# EAGLE design untitled (EAGLE 5.07)
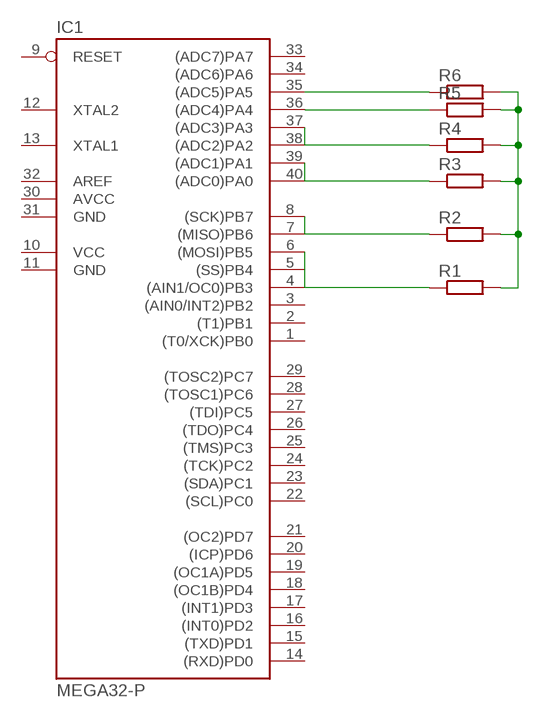
[diagram p0: schematic, sheet 1]

## Parts
IC1  MEGA32-P  [DIL40]
R1  R-EU_0207/10  [0207/10]
R2  R-EU_0207/10  [0207/10]
R3  R-EU_0207/10  [0207/10]
R4  R-EU_0207/10  [0207/10]
R5  R-EU_0207/10  [0207/10]
R6  R-EU_0207/10  [0207/10]

## Nets
N$1: IC1.35((ADC5)PA5) R6.1
N$2: IC1.36((ADC4)PA4) R5.1
N$3: IC1.37((ADC3)PA3) R4.1
N$4: IC1.39((ADC1)PA1) R3.1
N$5: IC1.8((SCK)PB7) R2.1
N$6: IC1.6((MOSI)PB5) R1.1
N$7: R1.2 R2.2 R3.2 R4.2 R5.2 R6.2
Unconnected: IC1.1((T0/XCK)PB0) IC1.2((T1)PB1) IC1.3((AIN0/INT2)PB2) IC1.4((AIN1/OC0)PB3) IC1.5((SS)PB4) IC1.7((MISO)PB6) IC1.9(RESET) IC1.12(XTAL2) IC1.13(XTAL1) IC1.14((RXD)PD0) IC1.15((TXD)PD1) IC1.16((INT0)PD2) IC1.17((INT1)PD3) IC1.18((OC1B)PD4) IC1.19((OC1A)PD5) IC1.20((ICP)PD6) IC1.21((OC2)PD7) IC1.22((SCL)PC0) IC1.23((SDA)PC1) IC1.24((TCK)PC2) IC1.25((TMS)PC3) IC1.26((TDO)PC4) IC1.27((TDI)PC5) IC1.28((TOSC1)PC6) IC1.29((TOSC2)PC7) IC1.32(AREF) IC1.33((ADC7)PA7) IC1.34((ADC6)PA6) IC1.38((ADC2)PA2) IC1.40((ADC0)PA0)

## Power pins joined to a net without a drawn wire
AVCC: IC1.30(AVCC)
GND: IC1.11(GND) IC1.31(GND)
VCC: IC1.10(VCC)

## Library data of the parts
IC1 = atmel:MEGA32-P: MICROCONTROLLER 32 Kbytes FLASH 2 Kbytes SRAM 1 Kbytes EEPROM USART 8-channel 10 bit ADC Source: www.atmel.com .. doc2503.pdf
R1-R6 = rcl:R-EU_: RESISTOR, European symbol

## Board
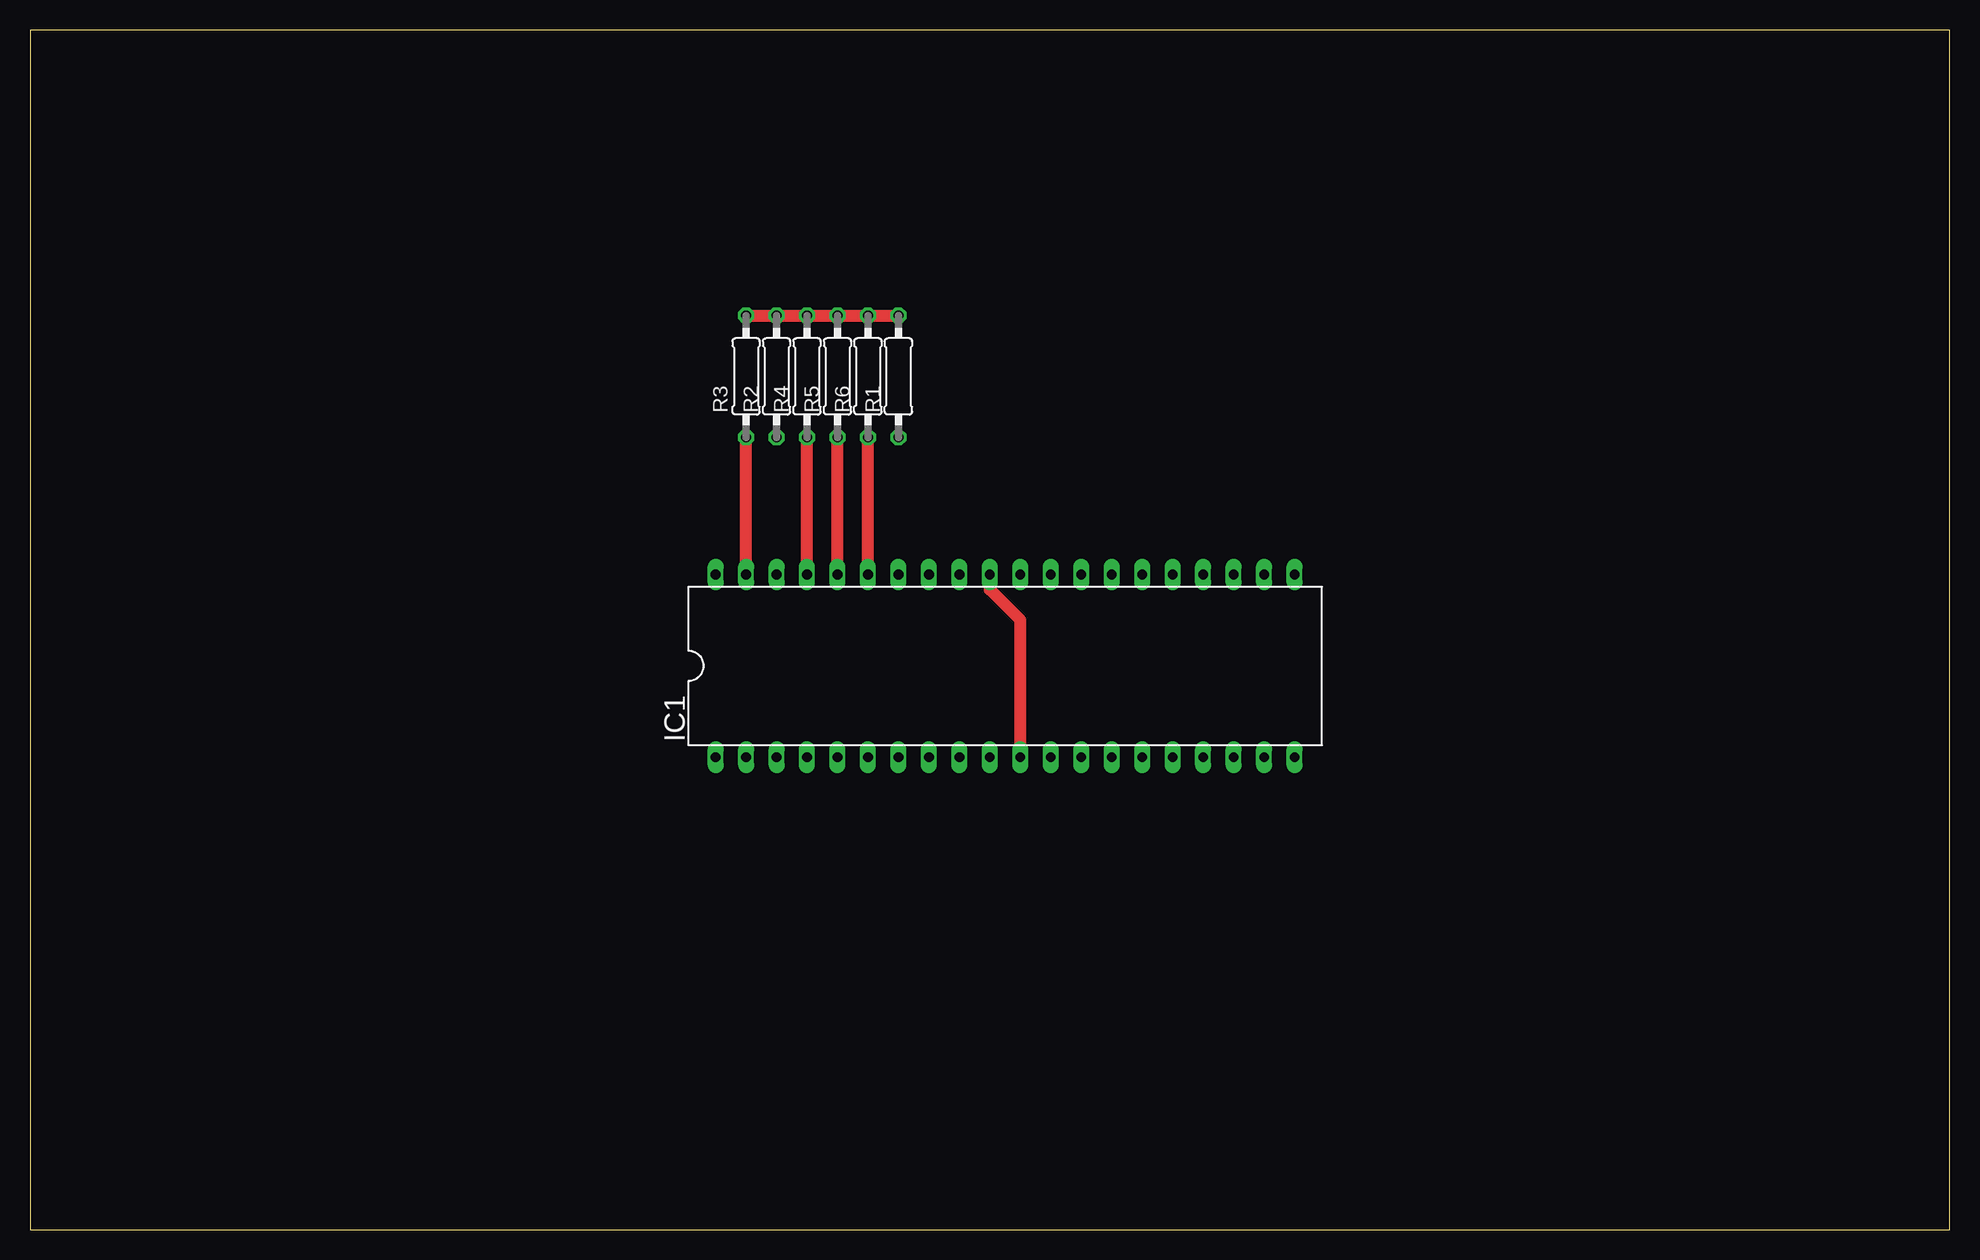
[diagram p1: board, top side]
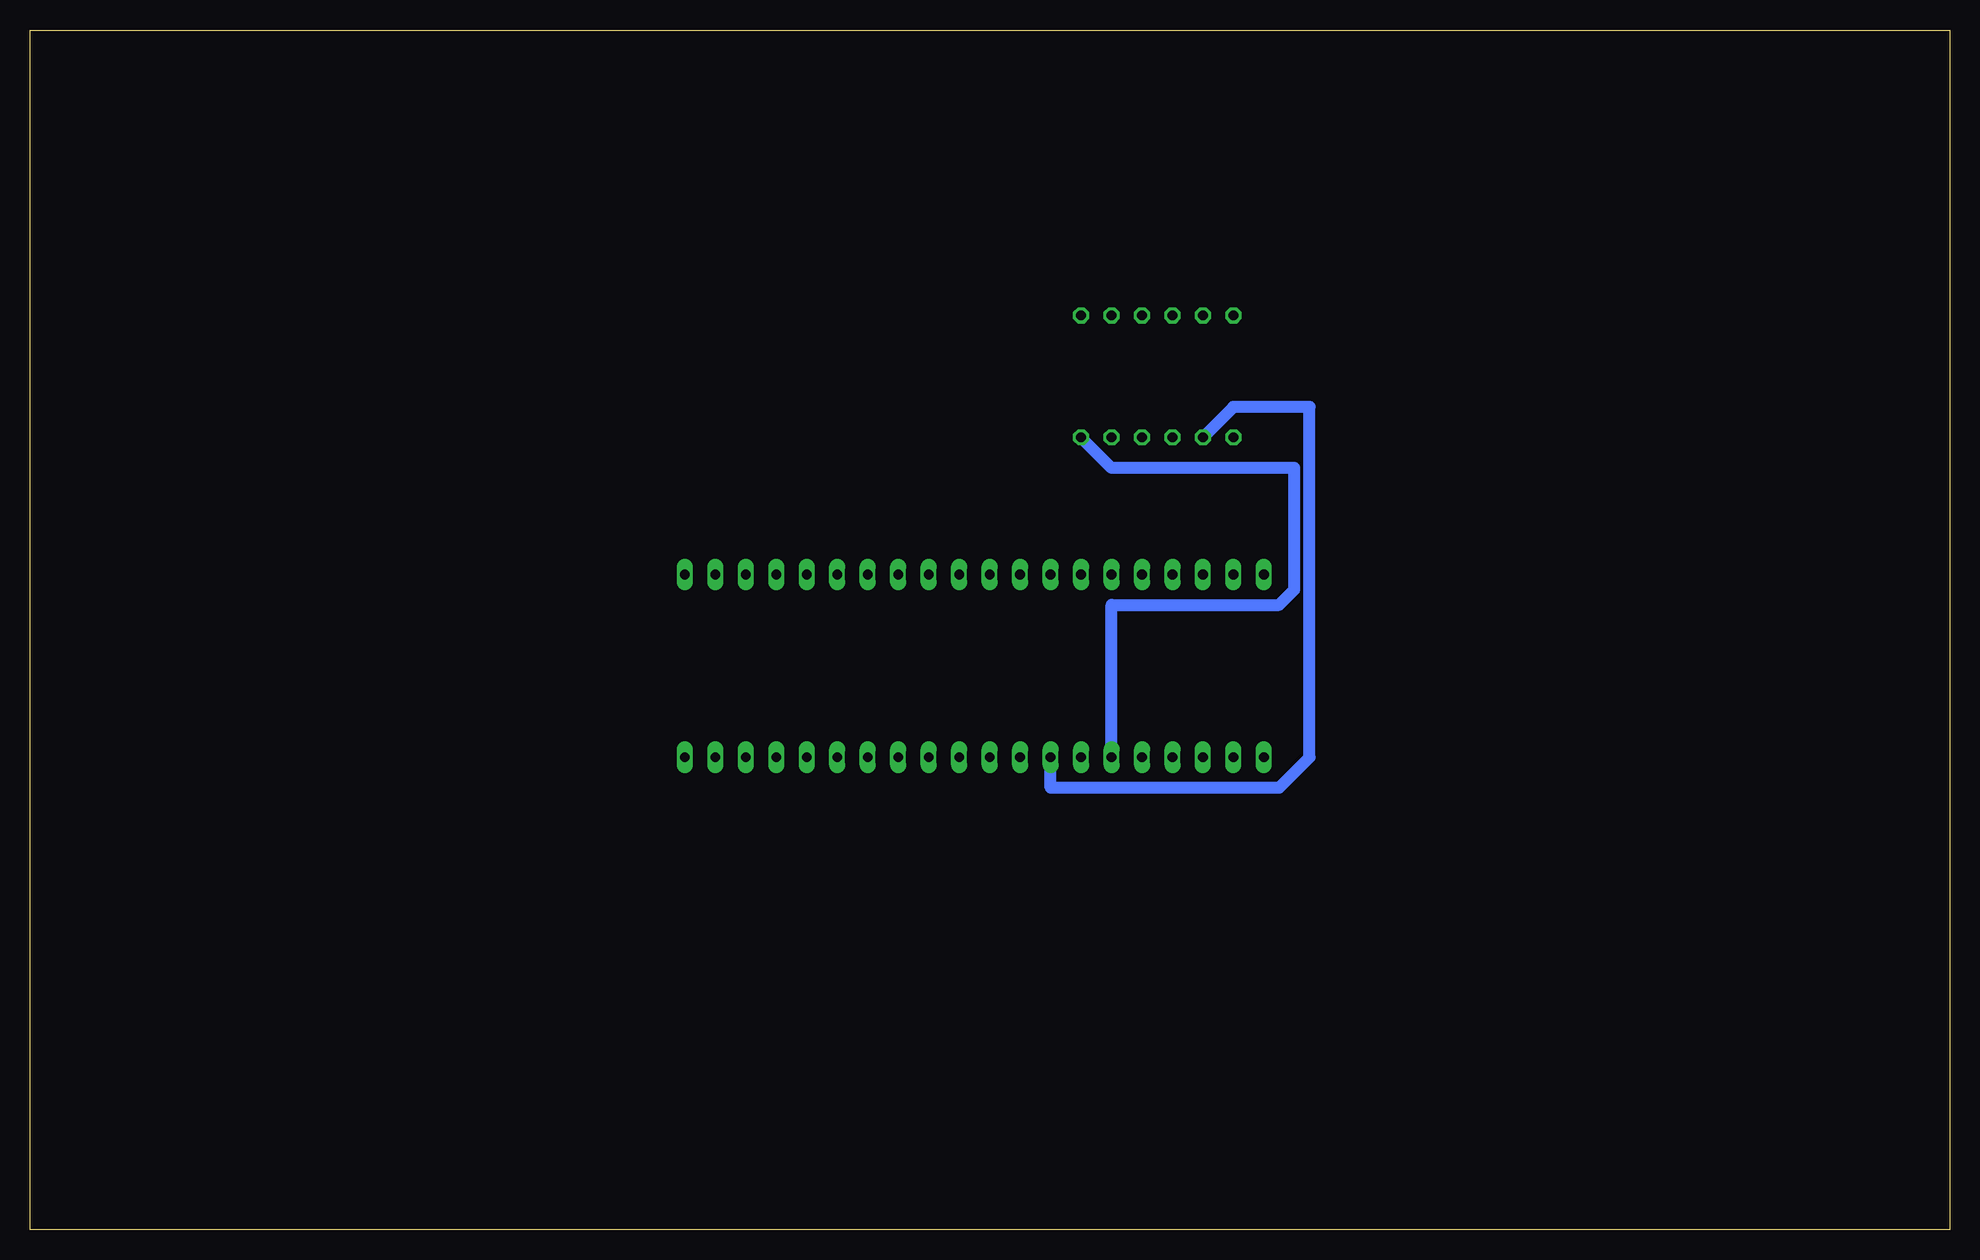
[diagram p2: board, bottom side, seen from below]

Size 160 x 100 mm. Coordinates in mm from the lower left corner, seen from the top.
Outline: 0,0 160,0 160,100 0,100 0,0
Copper layers (1*16): Top 0.035mm / dielectric 1.5mm / Bottom 0.035mm
Design rules "default *": minimum track width 40mil, minimum drill 10mil, track to track 8mil, track to pad 8mil, pad to pad 8mil, via to via 8mil, smd to smd 8mil, copper to edge 40mil, drill to drill 8mil, minimum pad ring 10mil, minimum via ring 8mil, stop-mask expansion 4mil, vias tented up to drill 0mil, thermal gap 10mil

### Footprints (pad centres in the part's own frame; a part is rotated, then mirrored left to right if it is on the bottom)
DIL40 = drill 0.813 long: 1 -24.13,-7.62; 2 -21.59,-7.62; 3 -19.05,-7.62; 4 -16.51,-7.62; 5 -13.97,-7.62; 6 -11.43,-7.62; 7 -8.89,-7.62; 8 -6.35,-7.62; 9 -3.81,-7.62; 10 -1.27,-7.62; 11 1.27,-7.62; 12 3.81,-7.62; 13 6.35,-7.62; 14 8.89,-7.62; 15 11.43,-7.62; 16 13.97,-7.62; 17 16.51,-7.62; 18 19.05,-7.62; 19 21.59,-7.62; 20 24.13,-7.62; 21 24.13,7.62; 22 21.59,7.62; 23 19.05,7.62; 24 16.51,7.62; 25 13.97,7.62; 26 11.43,7.62; 27 8.89,7.62; 28 6.35,7.62; 29 3.81,7.62; 30 1.27,7.62; 31 -1.27,7.62; 32 -3.81,7.62; 33 -6.35,7.62; 34 -8.89,7.62; 35 -11.43,7.62; 36 -13.97,7.62; 37 -16.51,7.62; 38 -19.05,7.62; 39 -21.59,7.62; 40 -24.13,7.62
0207/10 = drill 0.813 octagon: 1 -5.08,0; 2 5.08,0

### Placement (x,y rotation side)
IC1  81.28,46.99 0 top
R1  72.39,71.12 90 top
R2  62.23,71.12 90 top
R3  59.69,71.12 90 top
R4  64.77,71.12 90 top
R5  67.31,71.12 90 top
R6  69.85,71.12 90 top

### Tracks (layer width: path | path; a pad name or v marks a point on that pad's centre or on a via)
GND
  Top 1.016: IC1.11 82.55,50.8 80.01,53.34 IC1.31
N$1
  Top 1.016: IC1.35 R6.1
N$2
  Top 1.016: IC1.36 R5.1
N$3
  Top 1.016: IC1.37 R4.1
N$4
  Top 1.016: IC1.39 R3.1
N$5
  Bottom 1.016: IC1.8 74.93,36.83 55.88,36.83 53.34,39.37 53.34,68.58 59.69,68.58 R2.1
N$6
  Bottom 1.016: IC1.6 69.85,52.07 55.88,52.07 54.61,53.34 54.61,63.5 69.85,63.5 R1.1
N$7
  Top 1.016: R3.2 R2.2 R4.2 R5.2 R6.2 R1.2